# Altium schematic sheet BLDC_DEV_LKS074D(O)_V1.10.schdoc
size A1; SheetNumber: 1; SheetTotal: 1
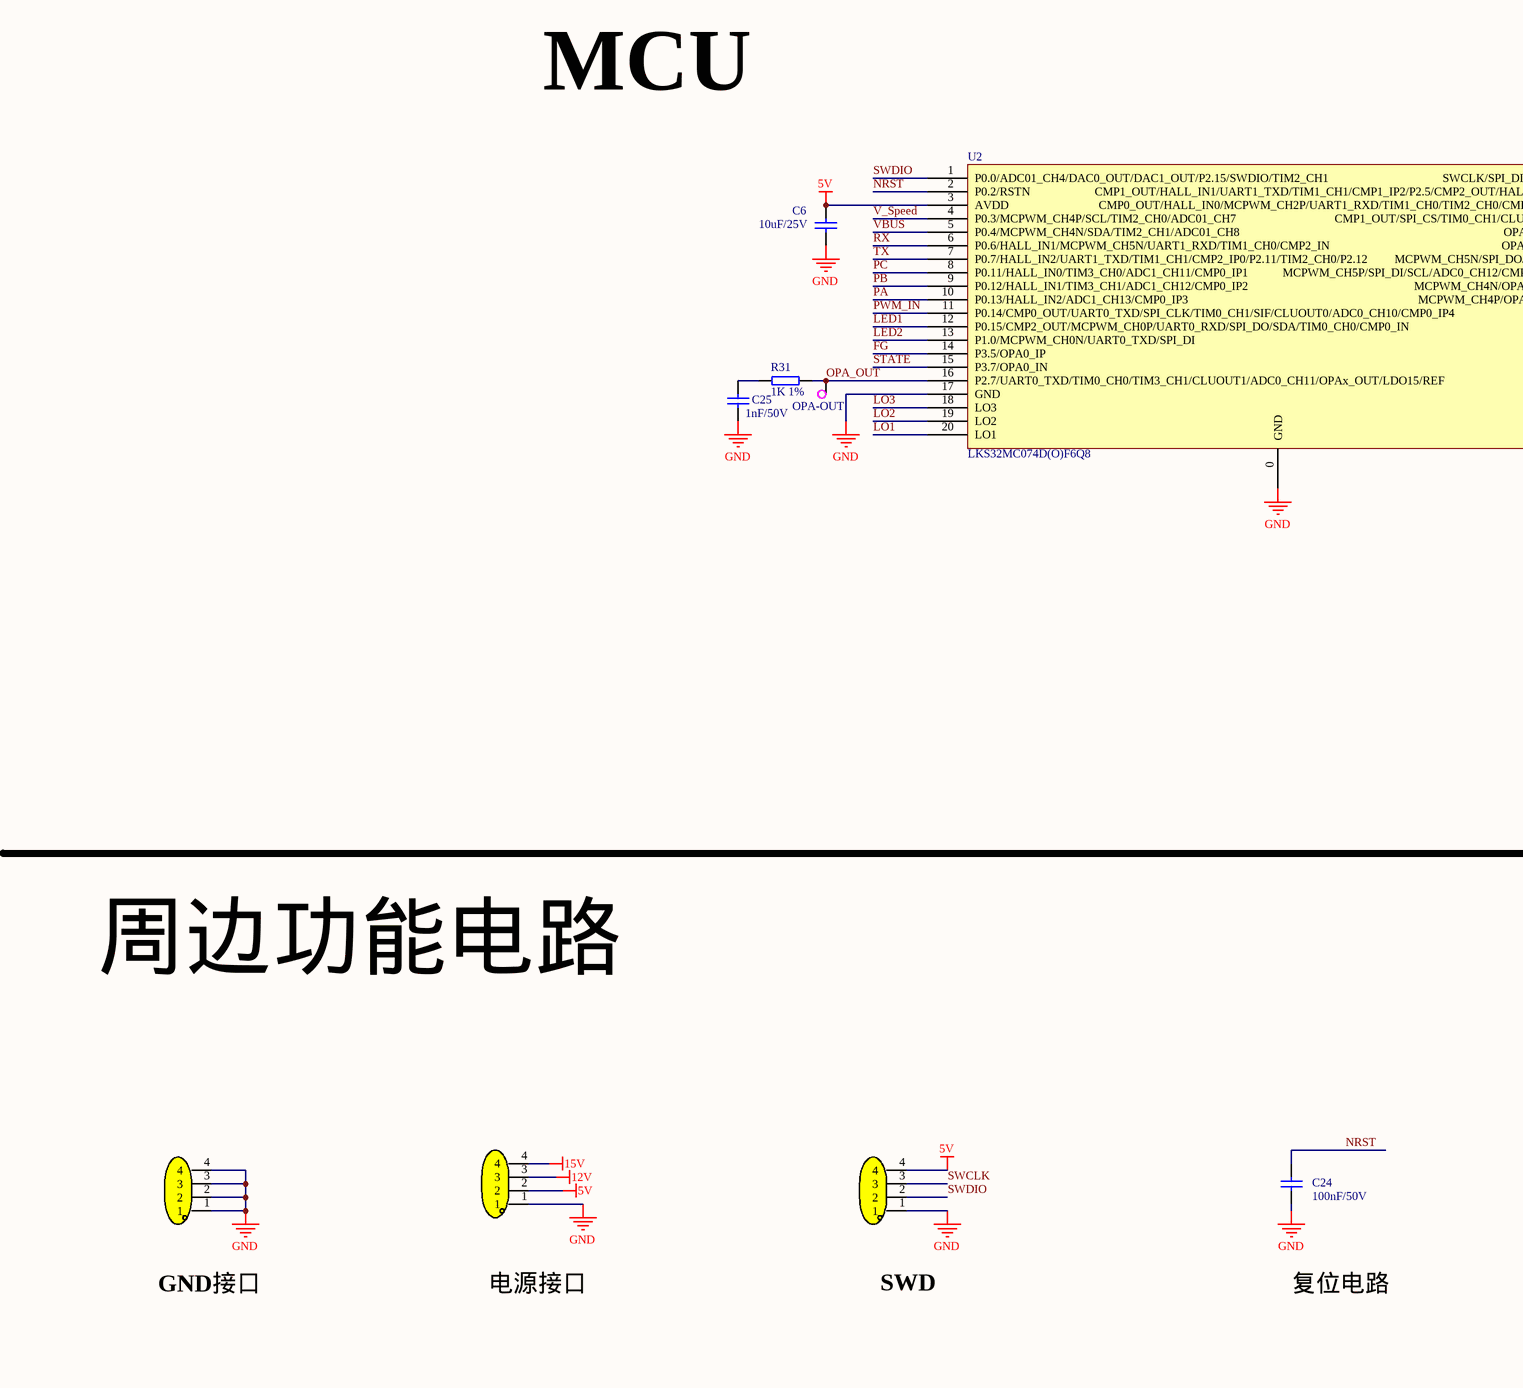
[diagram p0: BLDC_DEV_LKS074D(O)_V1.10.schdoc, top left]
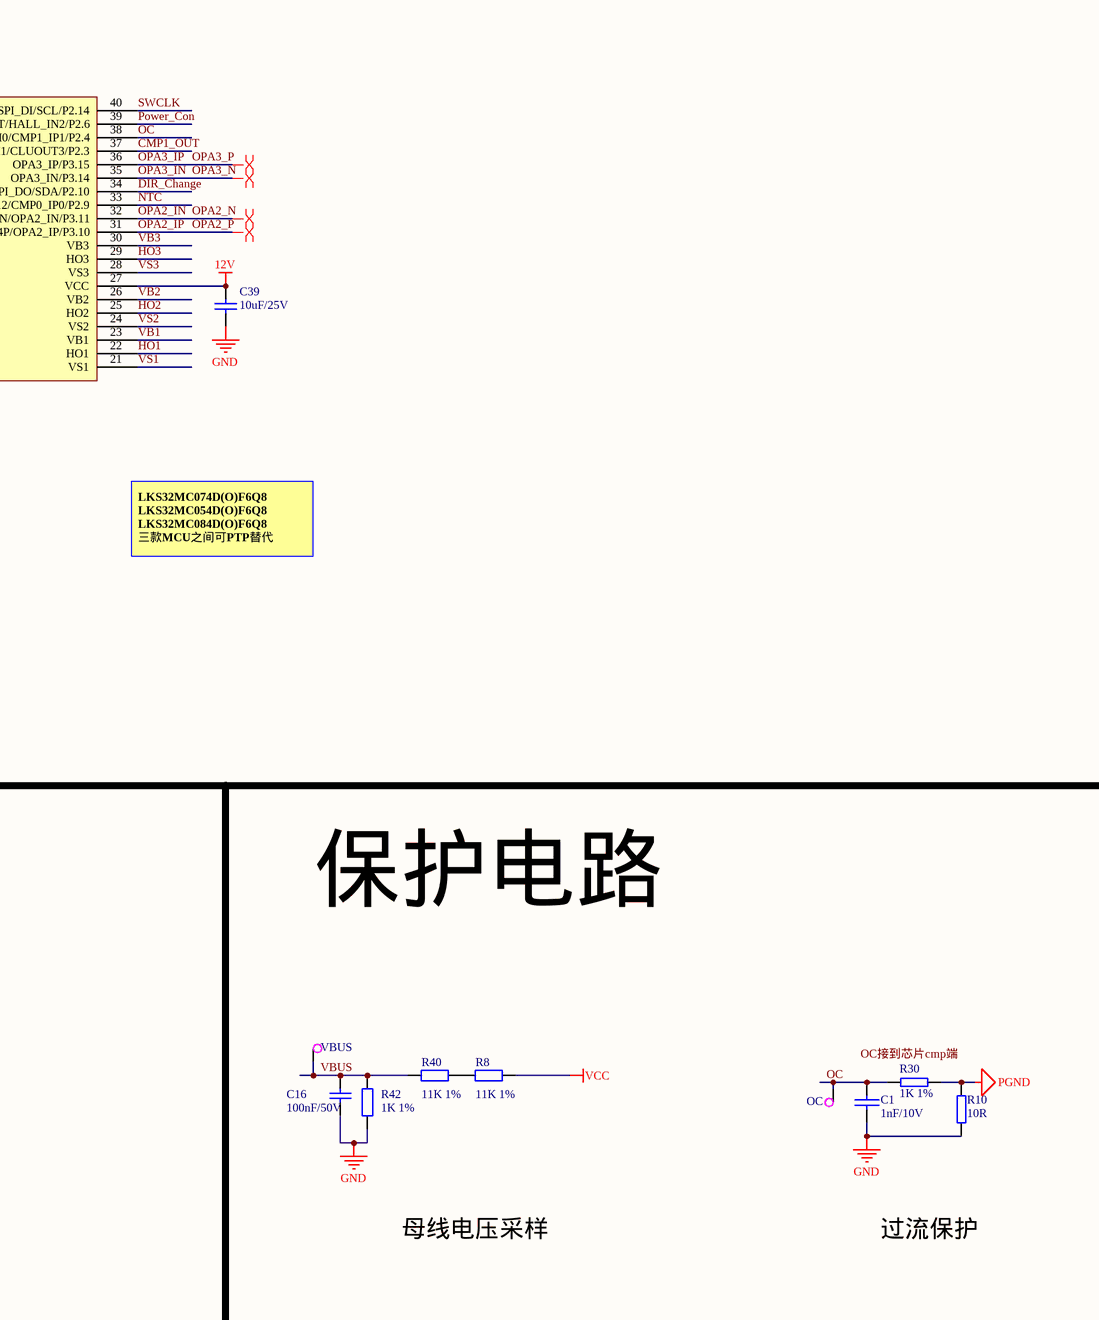
[diagram p1: BLDC_DEV_LKS074D(O)_V1.10.schdoc, top middle]
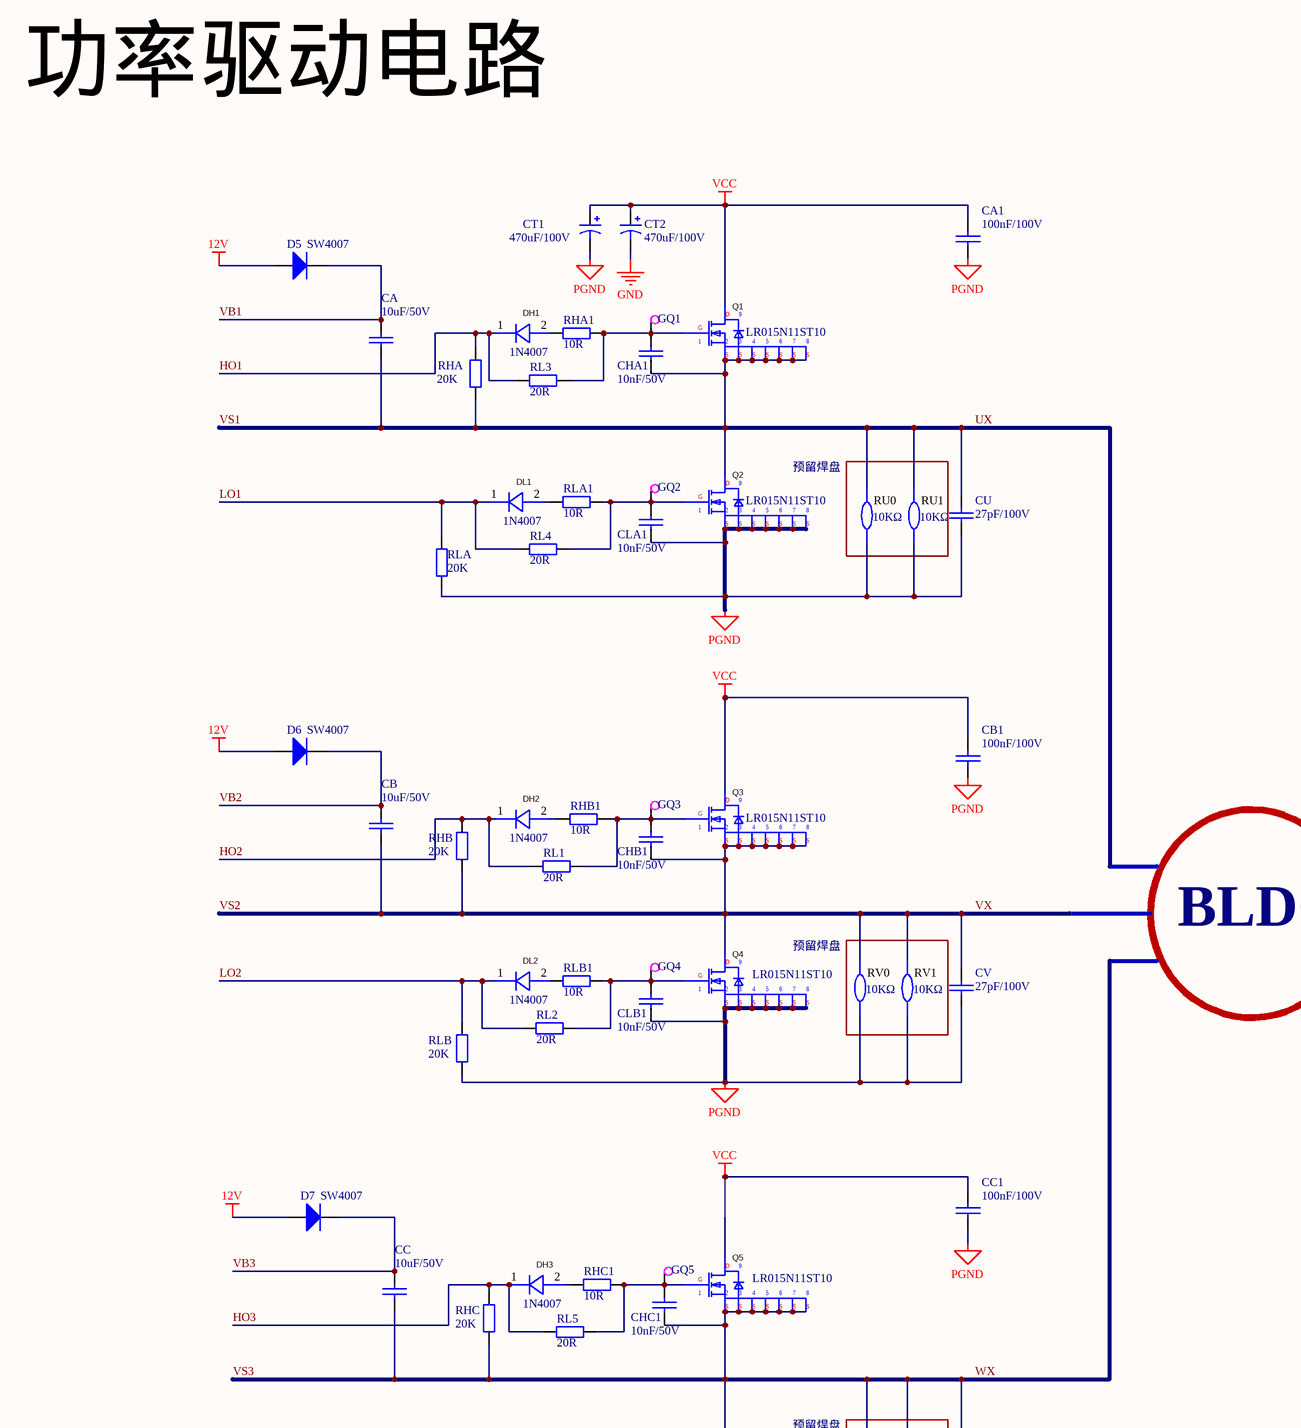
[diagram p2: BLDC_DEV_LKS074D(O)_V1.10.schdoc, top right]
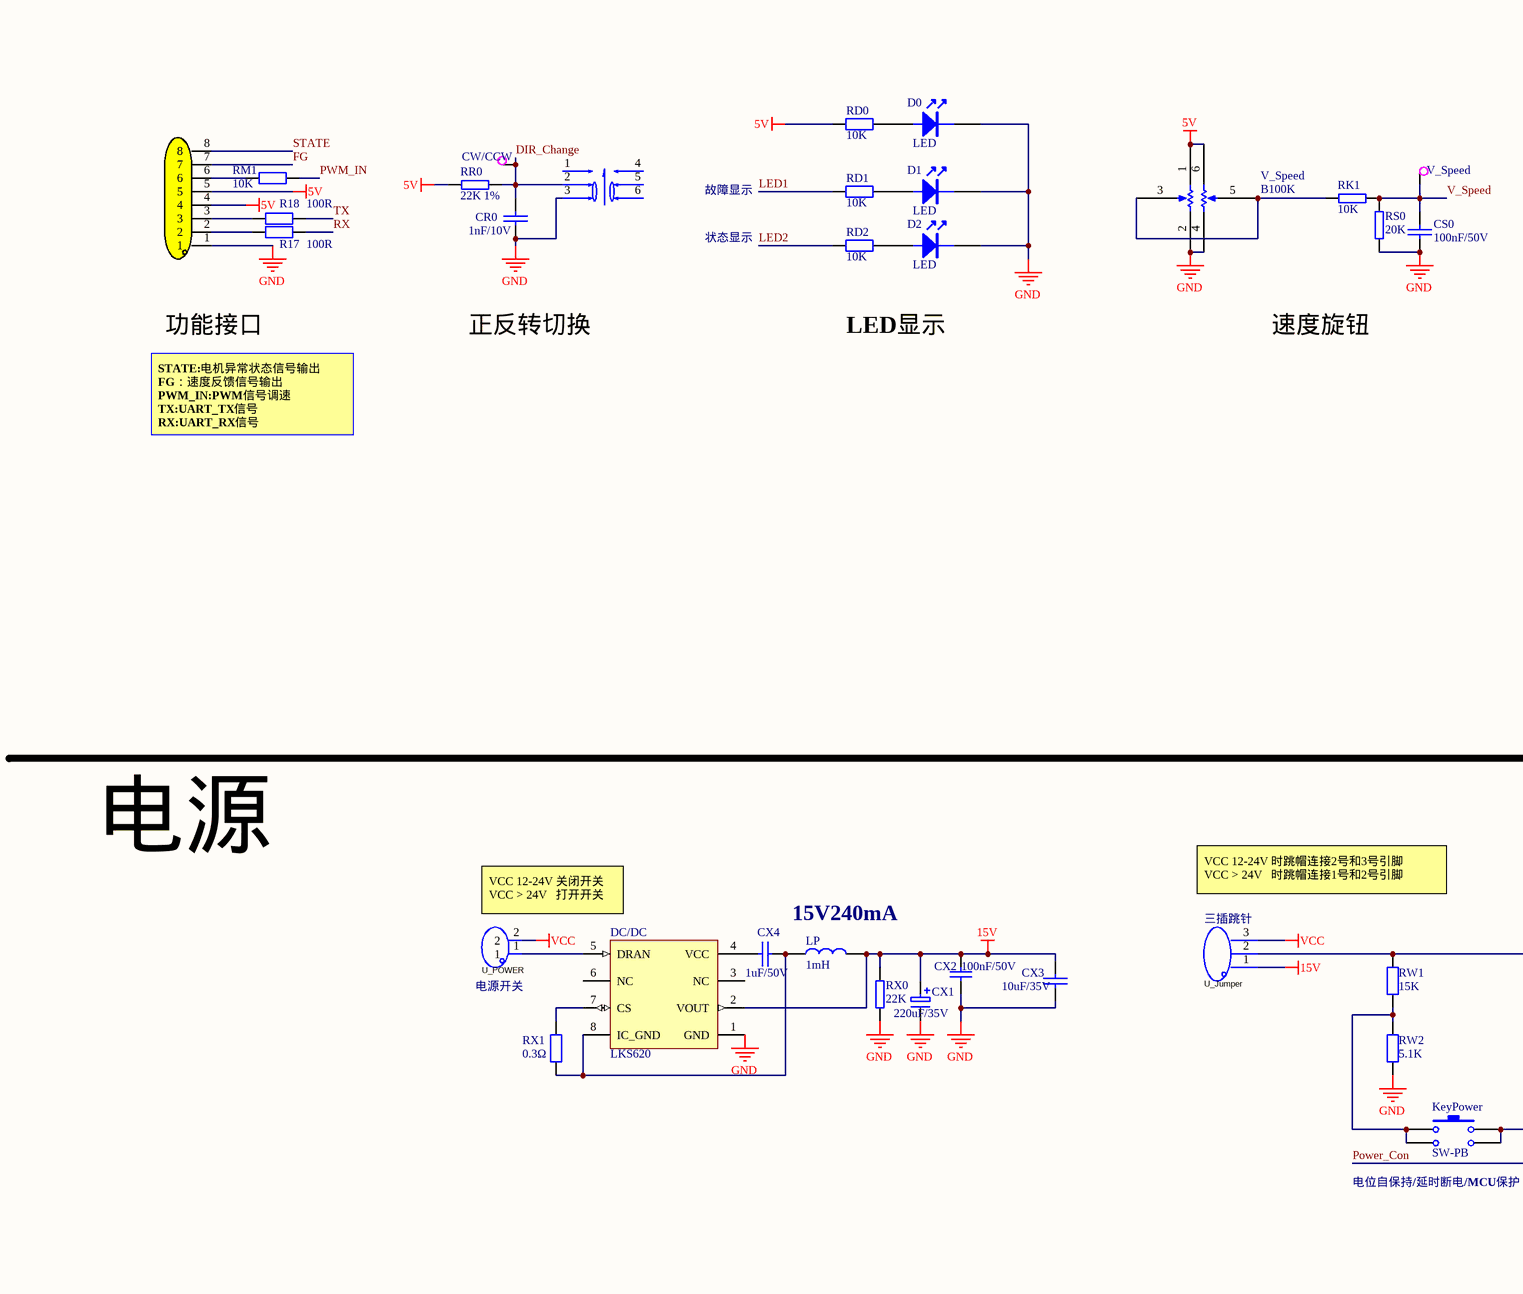
[diagram p3: BLDC_DEV_LKS074D(O)_V1.10.schdoc, bottom left]
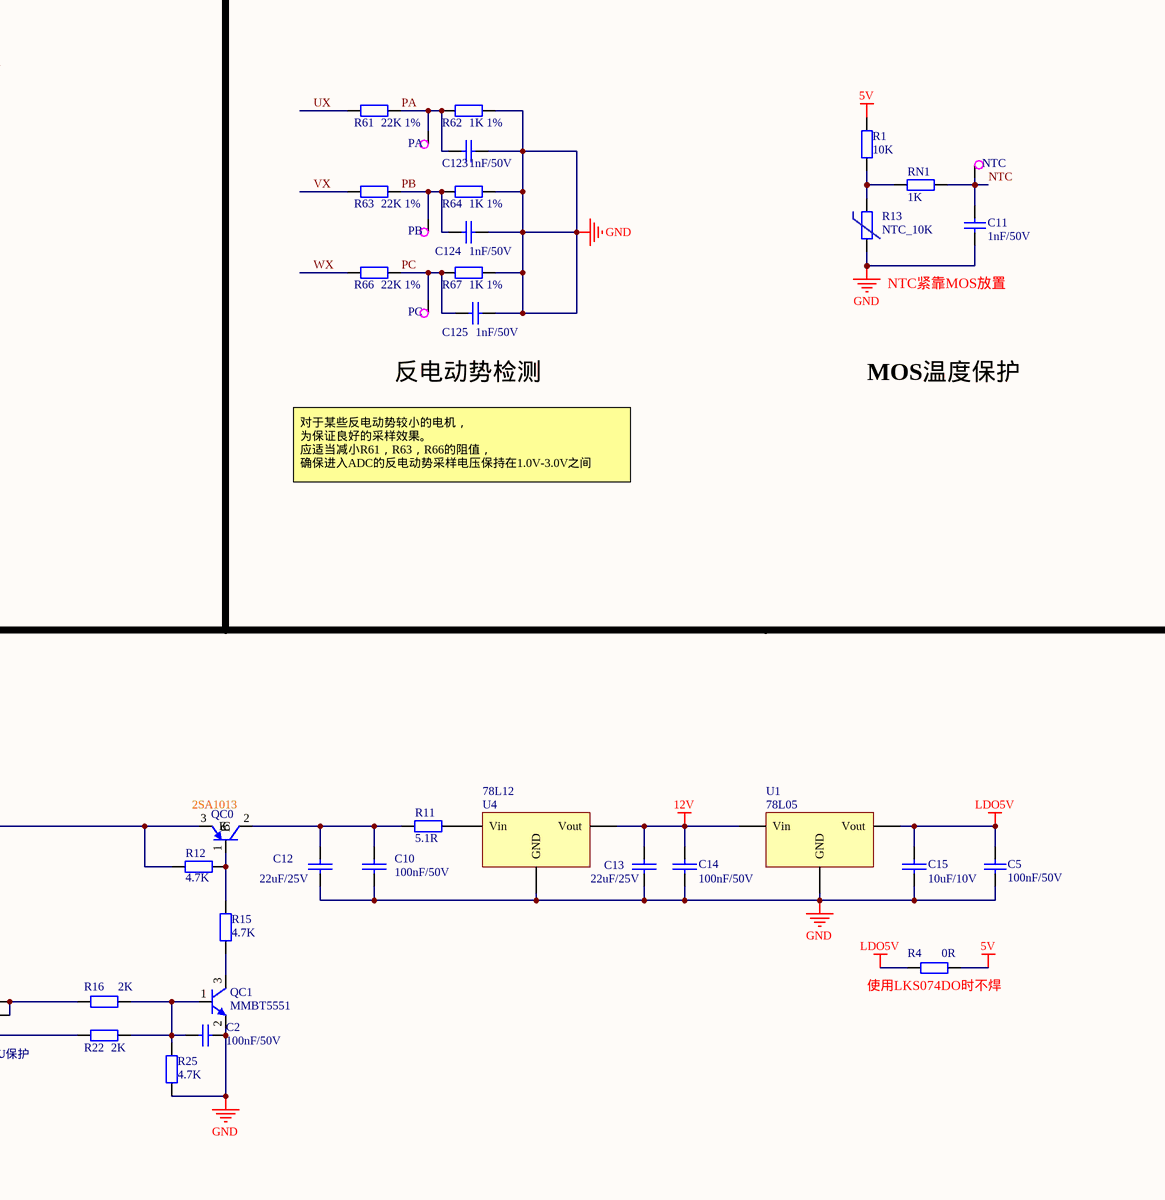
[diagram p4: BLDC_DEV_LKS074D(O)_V1.10.schdoc, bottom middle]
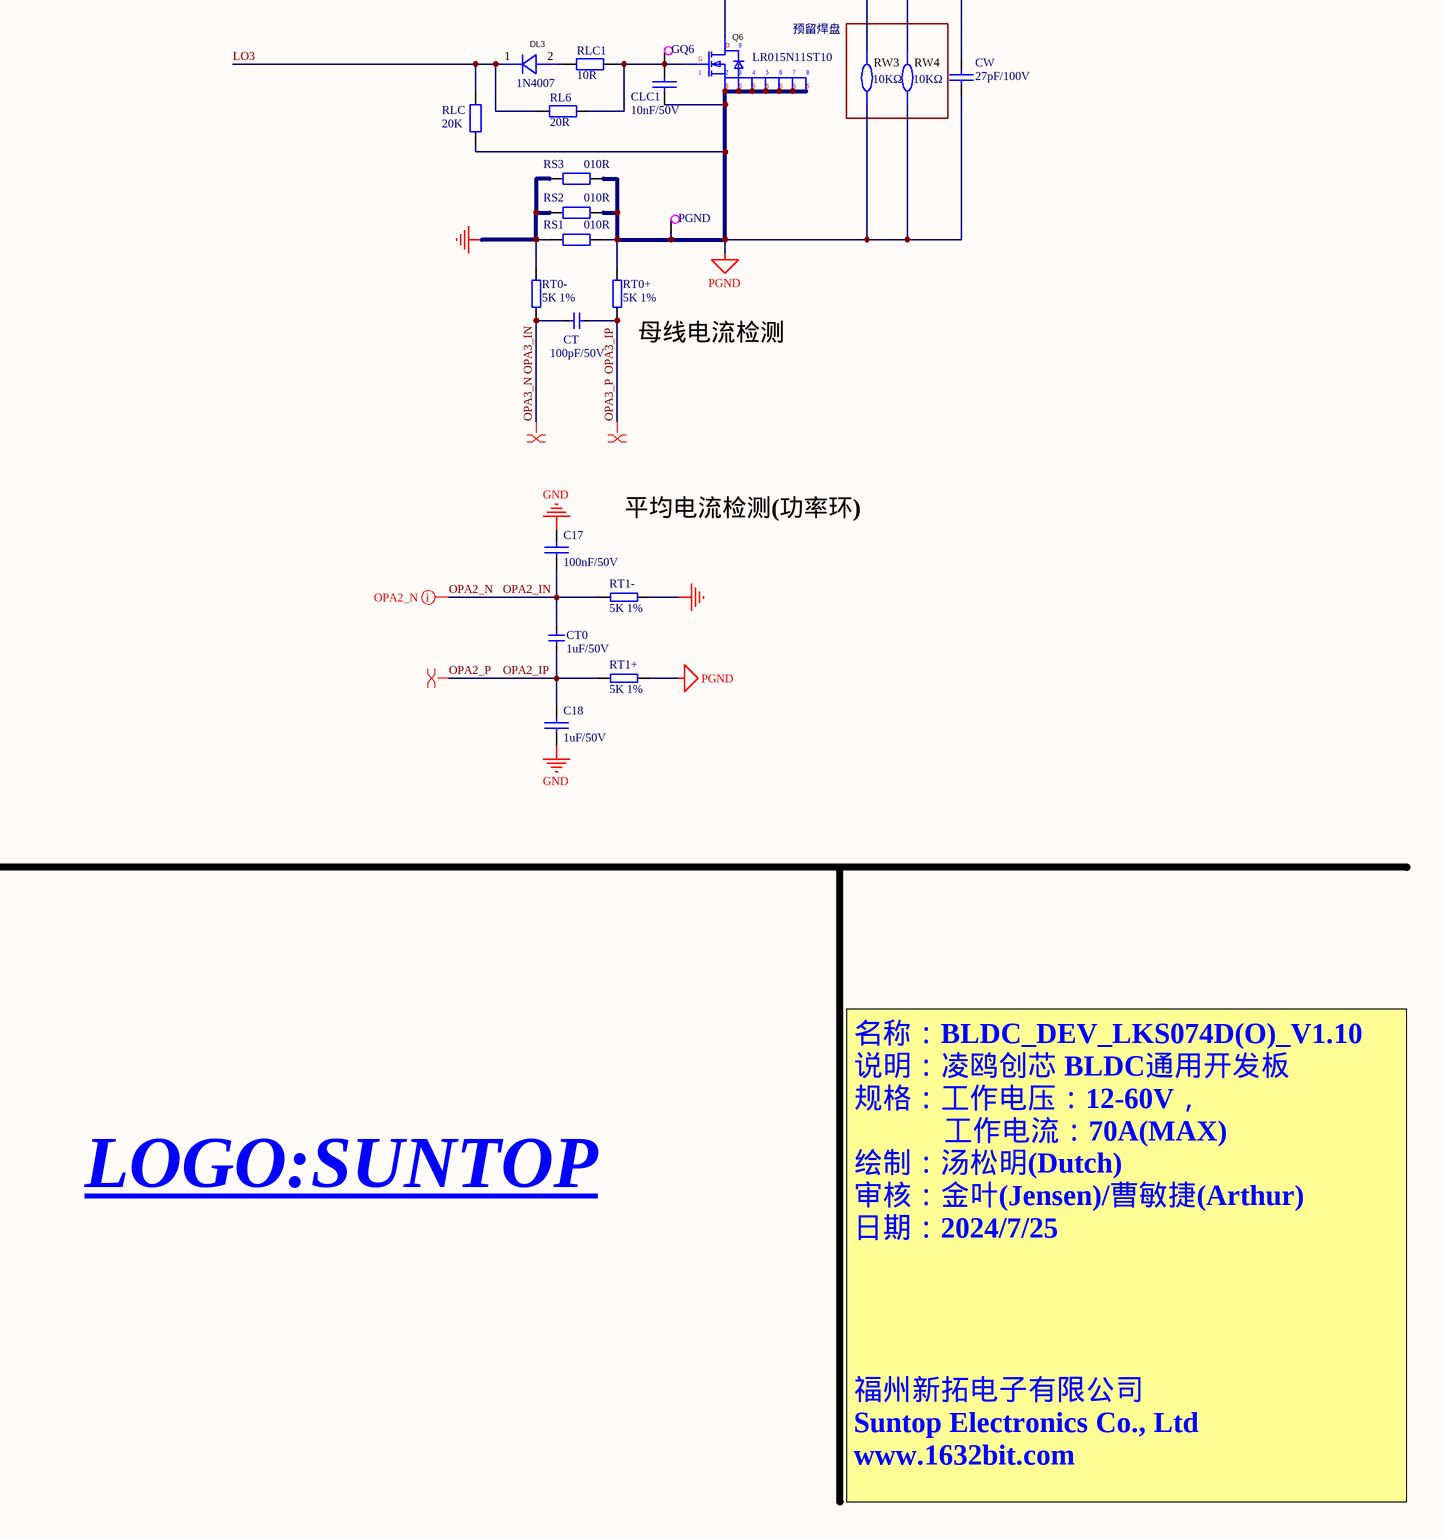
[diagram p5: BLDC_DEV_LKS074D(O)_V1.10.schdoc, bottom right]

## Parts
(Parts that share a designator on the sheet are numbered #1, #2 ... from top to bottom, then left to right.)
C1  1nF/10V  [0603C]
C2  100nF/50V  [0603C]
C5  100nF/50V  [0603C]
C6  10uF/25V  [0603C]
C10  100nF/50V  [0603C]
C11  1nF/50V  [0603C]
C12  22uF/25V  [1206]
C13  22uF/25V  [1206]
C14  100nF/50V  [0603C]
C15  10uF/10V  [1206]
C16  100nF/50V  [0603C]
C17  100nF/50V  [0603C]
C18  1uF/50V  [0603C]
C24  100nF/50V  [0603C]
C25  1nF/50V  [0603C]
C39  10uF/25V  [0805C]
C123  1nF/50V  [0603C]
C124  1nF/50V  [0603C]
C125  1nF/50V  [0603C]
CA  10uF/50V  [1206C]
CA1  100nF/100V  [0805C]
CB  10uF/50V  [1206C]
CB1  100nF/100V  [0805C]
CC  10uF/50V  [1206C]
CC1  100nF/100V  [0805C]
CHA1  10nF/50V  [0603C]
CHB1  10nF/50V  [0603C]
CHC1  10nF/50V  [0603C]
CLA1  10nF/50V  [0603C]
CLB1  10nF/50V  [0603C]
CLC1  10nF/50V  [0603C]
CR0  1nF/10V  [0603C]
CS0  100nF/50V  [0603C]
CT  100pF/50V  [0603C]
CT0  1uF/50V  [0603C]
CT1  470uF/100V  [CAP-TH_BD16.0-P7.50-D1.2-FD]
CT2  470uF/100V  [CAP-TH_BD16.0-P7.50-D1.2-FD]
CU  27pF/100V  [0603C]
CV  27pF/100V  [0603C]
CW  27pF/100V  [0603C]
CW/CCW#1  TestP  [TP-40]  (value not drawn)
CW/CCW#2  XKB7070-Z  [SW-TH_6P-L7.0-W7.0-P2.00]  (value not drawn)
CX1  220uF/35V  [EC-8]
CX2  100nF/50V  [0603C]
CX3  10uF/35V  [0603C]
CX4  1uF/50V  [0603C]
D0  LED  [LED0805-R-RD]
D1  LED  [LED0805-R-RD]
D2  LED  [LED0805-R-RD]
D5  SW4007  [SOD-123]
D6  SW4007  [SOD-123]
D7  SW4007  [SOD-123]
DC/DC  LKS620  [SOP8-NCE4614]
DH1  1N4007  [SMA_L4.3-W2.5-LS5.0-RD]
DH2  1N4007  [SMA_L4.3-W2.5-LS5.0-RD]
DH3  1N4007  [SMA_L4.3-W2.5-LS5.0-RD]
DL1  1N4007  [SMA_L4.3-W2.5-LS5.0-RD]
DL2  1N4007  [SMA_L4.3-W2.5-LS5.0-RD]
DL3  1N4007  [SMA_L4.3-W2.5-LS5.0-RD]
FUN-PIN  ZX-XH2.54-8PZZ  [CONN-TH_8P-P2.50-XH2.54-8P]  (value not drawn)
GND  ZX-XH2.54-4PZZ  [CONN-TH_4P-P2.50_4PIN]  (value not drawn)
GQ1  TestP  [TP-40]  (value not drawn)
GQ2  TestP  [TP-40]  (value not drawn)
GQ3  TestP  [TP-40]  (value not drawn)
GQ4  TestP  [TP-40]  (value not drawn)
GQ5  TestP  [TP-40]  (value not drawn)
GQ6  TestP  [TP-40]  (value not drawn)
KeyPower  SW-PB  [SW-PB  12*12]
LP  1mH  [IND-TH_BD9.5-P5.20-D0.6]
NTC  TestP  [TP-40]  (value not drawn)
OC  TestP  [TP-40]  (value not drawn)
OPA-OUT  TestP  [TP-40]  (value not drawn)
PA  TestP  [TP-40]  (value not drawn)
PB  TestP  [TP-40]  (value not drawn)
PC  TestP  [TP-40]  (value not drawn)
PGND  TestP  [TP-40]  (value not drawn)
POWER  ZX-XH2.54-4PZZ  [CONN-TH_4P-P2.50_4PIN]  (value not drawn)
Q1  LR015N11ST10  [TOLL-8L]
Q2  LR015N11ST10  [TOLL-8L]
Q3  LR015N11ST10  [TOLL-8L]
Q4  LR015N11ST10  [TOLL-8L]
Q5  LR015N11ST10  [TOLL-8L]
Q6  LR015N11ST10  [TOLL-8L]
QC0  2SA1013  [SOT89N]
QC1  MMBT5551  [SOT-23]
R1  10K  [0603R]
R4  0R  [0603R]
R8  11K 1%  [0603R]
R10  10R  [0603R]
R11  5.1R  [0603R]
R12  4.7K  [0603R]
R13  NTC_10K  [0805R]
R15  4.7K  [0603R]
R16  2K  [0603R]
R17  100R  [0603R]
R18  100R  [0603R]
R22  2K  [0603R]
R25  4.7K  [0603R]
R30  1K 1%  [0603R]
R31  1K 1%  [0603R]
R40  11K 1%  [0603R]
R42  1K 1%  [0603R]
R61  22K 1%  [0603R]
R62  1K 1%  [0603R]
R63  22K 1%  [0603R]
R64  1K 1%  [0603R]
R66  22K 1%  [0603R]
R67  1K 1%  [0603R]
RD0  10K  [0603R]
RD1  10K  [0603R]
RD2  10K  [0603R]
RHA  20K  [0603R]
RHA1  10R  [0603R]
RHB  20K  [0603R]
RHB1  10R  [0603R]
RHC  20K  [0603R]
RHC1  10R  [0603R]
RK1  10K  [0603R]
RL1  20R  [0603R]
RL2  20R  [0603R]
RL3  20R  [0603R]
RL4  20R  [0603R]
RL5  20R  [0603R]
RL6  20R  [0603R]
RLA  20K  [0603R]
RLA1  10R  [0603R]
RLB  20K  [0603R]
RLB1  10R  [0603R]
RLC  20K  [0603R]
RLC1  10R  [0603R]
RM1  10K  [0603R]
RN1  1K  [0603R]
RR0  22K 1%  [0603R]
RS0  20K  [0603R]
RS1  010R  [2512R]
RS2  010R  [2512R]
RS3  010R  [2512R]
RT0+  5K 1%  [0603R]
RT0-  5K 1%  [0603R]
RT1+  5K 1%  [0603R]
RT1-  5K 1%  [0603R]
RU0  10KΩ  [R1206]
RU1  10KΩ  [R1206]
RV0  10KΩ  [R1206]
RV1  10KΩ  [R1206]
RW1  15K  [0603R]
RW2  5.1K  [0603R]
RW3  10KΩ  [R1206]
RW4  10KΩ  [R1206]
RX0  22K  [0603R]
RX1  0.3Ω  [0603R]
SWD  ZX-XH2.54-4PZZ  [CONN-TH_4P-P2.50_4PIN]  (value not drawn)
U1  78L05  [SOT89]
U2  LKS32MC074D(O)F6Q8  [QFN40]
U4  78L12  [SOT89]
U_Jumper  826629-3  [HDR-TH_3P-P2.54-V-M-1]  (value not drawn)
U_POWER  SDDJE11600  [SW-TH_SDDJE11600]  (value not drawn)
V_Speed#1  TestP  [TP-40]  (value not drawn)
V_Speed#2  B100K  [RK097-W]
VBUS  TestP  [TP-40]  (value not drawn)

## Nets
5V: C6.2 FUN-PIN.4 FUN-PIN.5 POWER.2 R1.2 R4.2 RD0.1 RR0.2 SWD.4 U2.3(AVDD) V_Speed#2.1(TOP) V_Speed#2.6(TOP)
12V: C13.1 C14.1 C39.2 D5.1(A) D6.1(A) D7.1(A) POWER.3 U1.3(Vin) U2.27(VCC) U4.1(Vout)
15V: CX1.1 CX2.2 CX3.2 DC/DC.2(VOUT) LP.2 POWER.4 RX0.2 U_Jumper.1
GND: C1.2 C2.2 C5.1 C6.1 C10.2 C11.1 C12.2 C13.2 C14.2 C15.2 C16.2 C17.1 C18.2 C24.1 C25.1 C39.1 C123.2 C124.2 C125.2 CR0.2 CS0.2 CT2.2 CW/CCW#2.3 CX1.2 CX2.1 CX3.1 D0.2(K) D1.2(K) D2.2(K) DC/DC.1(GND) FUN-PIN.1 GND.1 GND.2 GND.3 GND.4 POWER.1 QC1.2(E) R10.2 R13.1 R25.1 R42.1 R62.1 R64.1 R67.1 RS0.1 RS1.2 RS2.2 RS3.2 RT0-.2 RT1-.1 RW2.1 RX0.1 SWD.1 U1.2(GND) U2.0(GND) U2.17(GND) U4.2(GND) V_Speed#2.2(TAP) V_Speed#2.4(BOT)
LDO5V: C5.2 C15.1 R4.1 U1.1(Vout)
PGND: CA1.2 CB1.2 CC1.2 CLA1.2 CLB1.2 CLC1.2 CT1.2 CU.2 CV.2 CW.2 PGND.1 Q2.2(S) Q2.3(S) Q2.4(S) Q2.5(S) Q2.6(S) Q2.7(S) Q2.8(S) Q4.2(S) Q4.3(S) Q4.4(S) Q4.5(S) Q4.6(S) Q4.7(S) Q4.8(S) Q6.2(S) Q6.3(S) Q6.4(S) Q6.5(S) Q6.6(S) Q6.7(S) Q6.8(S) R10.1 R30.1 RLA.1 RLB.1 RLC.1 RS1.1 RS2.1 RS3.1 RT0+.2 RT1+.1 RU0.1 RU1.1 RV0.1 RV1.1 RW3.1 RW4.1
VCC: CA1.1 CB1.1 CC1.1 CT1.1 CT2.1 Q1.9(D) Q3.9(D) Q5.9(D) R8.1 U_Jumper.3 U_POWER.2
CMP1_OUT: U2.37(CMP1_OUT/SPI_CS/TIM0_CH1/CLUOUT3/P2.3)
DIR_Change: CR0.1 CW/CCW#1.1 CW/CCW#2.2 RR0.1 U2.34(MCPWM_CH5N/SPI_DO/SDA/P2.10)
FG: FUN-PIN.7 U2.14(P3.5/OPA0_IP)
HO1: DH1.1(K) RHA.2 RL3.1 U2.22(HO1)
HO2: DH2.1(K) RHB.2 RL1.1 U2.25(HO2)
HO3: DH3.1(K) RHC.2 RL5.1 U2.29(HO3)
LED1: RD1.1 U2.12(P0.15/CMP2_OUT/MCPWM_CH0P/UART0_RXD/SPI_DO/SDA/TIM0_CH0/CMP0_IN)
LED2: RD2.1 U2.13(P1.0/MCPWM_CH0N/UART0_TXD/SPI_DI)
LO1: DL1.1(K) RL4.1 RLA.2 U2.20(LO1)
LO2: DL2.1(K) RL2.1 RLB.2 U2.19(LO2)
LO3: DL3.1(K) RL6.1 RLC.2 U2.18(LO3)
NRST: C24.2 U2.2(P0.2/RSTN)
NTC: C11.2 NTC.1 RN1.1 U2.33(MCPWM_CH5P/SPI_DI/SCL/ADC0_CH12/CMP0_IP0/P2.9)
OC: C1.1 OC.1 R30.2 U2.38(CMP0_OUT/HALL_IN0/MCPWM_CH2P/UART1_RXD/TIM1_CH0/TIM2_CH0/CMP1_IP1/P2.4)
OPA2_IN: C17.2 CT0.1 RT1-.2 U2.32(MCPWM_CH4N/OPA2_IN/P3.11)  [also labelled OPA2_N]
OPA2_IP: C18.1 CT0.2 RT1+.2 U2.31(MCPWM_CH4P/OPA2_IP/P3.10)  [also labelled OPA2_P]
OPA3_IN: CT.2 RT0-.1 U2.35(OPA3_IN/P3.14)  [also labelled OPA3_N]
OPA3_IP: CT.1 RT0+.1 U2.36(OPA3_IP/P3.15)  [also labelled OPA3_P]
OPA_OUT: OPA-OUT.1 R31.1 U2.16(P2.7/UART0_TXD/TIM0_CH0/TIM3_CH1/CLUOUT1/ADC0_CH11/OPAx_OUT/LDO15/REF)
PA: C123.1 PA.1 R61.1 R62.2 U2.10(P0.13/HALL_IN2/ADC1_CH13/CMP0_IP3)
PB: C124.1 PB.1 R63.1 R64.2 U2.9(P0.12/HALL_IN1/TIM3_CH1/ADC1_CH12/CMP0_IP2)
PC: C125.1 PC.1 R66.1 R67.2 U2.8(P0.11/HALL_IN0/TIM3_CH0/ADC1_CH11/CMP0_IP1)
Power_Con: R22.1 U2.39(CMP1_OUT/HALL_IN1/UART1_TXD/TIM1_CH1/CMP1_IP2/P2.5/CMP2_OUT/HALL_IN2/P2.6)
PWM_IN: RM1.2 U2.11(P0.14/CMP0_OUT/UART0_TXD/SPI_CLK/TIM0_CH1/SIF/CLUOUT0/ADC0_CH10/CMP0_IP4)
RX: R17.2 U2.6(P0.6/HALL_IN1/MCPWM_CH5N/UART1_RXD/TIM1_CH0/CMP2_IN)
STATE: FUN-PIN.8 U2.15(P3.7/OPA0_IN)
SWCLK: SWD.3 U2.40(SWCLK/SPI_DI/SCL/P2.14)
SWDIO: SWD.2 U2.1(P0.0/ADC01_CH4/DAC0_OUT/DAC1_OUT/P2.15/SWDIO/TIM2_CH1)
TX: R18.2 U2.7(P0.7/HALL_IN2/UART1_TXD/TIM1_CH1/CMP2_IP0/P2.11/TIM2_CH0/P2.12)
UX: CA.2 CHA1.2 CU.1 Q1.2(S) Q1.3(S) Q1.4(S) Q1.5(S) Q1.6(S) Q1.7(S) Q1.8(S) Q2.9(D) R61.2 RHA.1 RU0.2 RU1.2 U2.21(VS1)  [also labelled VS1]
V_Speed: CS0.1 RK1.2 RS0.2 U2.4(P0.3/MCPWM_CH4P/SCL/TIM2_CH0/ADC01_CH7) V_Speed#1.1
VB1: CA.1 D5.2(K) U2.23(VB1)
VB2: CB.1 D6.2(K) U2.26(VB2)
VB3: CC.1 D7.2(K) U2.30(VB3)
VBUS: C16.1 R40.2 R42.2 U2.5(P0.4/MCPWM_CH4N/SDA/TIM2_CH1/ADC01_CH8) VBUS.1
VS2: CB.2 CHB1.2 CV.1 Q3.2(S) Q3.3(S) Q3.4(S) Q3.5(S) Q3.6(S) Q3.7(S) Q3.8(S) Q4.9(D) R63.2 RHB.1 RV0.2 RV1.2 U2.24(VS2)  [also labelled VX]
VS3: CC.2 CHC1.2 CW.1 Q5.2(S) Q5.3(S) Q5.4(S) Q5.5(S) Q5.6(S) Q5.7(S) Q5.8(S) Q6.9(D) R66.2 RHC.1 RW3.2 RW4.2 U2.28(VS3)  [also labelled WX]
NetC2_1: C2.1 QC1.1(B) R16.1 R22.2 R25.2
NetC10_1: C10.1 C12.1 QC0.2(C) R11.1
NetC25_2: C25.2 R31.2
NetCHA1_1: CHA1.1 GQ1.1 Q1.1(G) RHA1.2 RL3.2
NetCHB1_1: CHB1.1 GQ3.1 Q3.1(G) RHB1.2 RL1.2
NetCHC1_1: CHC1.1 GQ5.1 Q5.1(G) RHC1.2 RL5.2
NetCLA1_1: CLA1.1 GQ2.1 Q2.1(G) RL4.2 RLA1.2
NetCLB1_1: CLB1.1 GQ4.1 Q4.1(G) RL2.2 RLB1.2
NetCLC1_1: CLC1.1 GQ6.1 Q6.1(G) RL6.2 RLC1.2
NetCX4_1: CX4.1 DC/DC.8(IC_GND) LP.1 RX1.1
NetCX4_2: CX4.2 DC/DC.4(VCC)
NetD0_1: D0.1(A) RD0.2
NetD1_1: D1.1(A) RD1.2
NetD2_1: D2.1(A) RD2.2
NetDC/DC_5: DC/DC.5(DRAN) U_POWER.1
NetDC/DC_7: DC/DC.7(CS) RX1.2
NetDH1_2: DH1.2(A) RHA1.1
NetDH2_2: DH2.2(A) RHB1.1
NetDH3_2: DH3.2(A) RHC1.1
NetDL1_2: DL1.2(A) RLA1.1
NetDL2_2: DL2.2(A) RLB1.1
NetDL3_2: DL3.2(A) RLC1.1
NetFUN-PIN_2: FUN-PIN.2 R17.1
NetFUN-PIN_3: FUN-PIN.3 R18.1
NetFUN-PIN_6: FUN-PIN.6 RM1.1
NetKeyPower_1: KeyPower.1 KeyPower.3 RW1.1 RW2.2
NetKeyPower_2: KeyPower.2 KeyPower.4 R16.2
NetQC0_1: QC0.1(B) R12.2 R15.1
NetQC0_3: QC0.3(E) R12.1 RW1.2 U_Jumper.2
NetQC1_3: QC1.3(C) R15.2
NetR1_1: R1.1 R13.2 RN1.2
NetR8_2: R8.2 R40.1
NetR11_2: R11.2 U4.3(Vin)
NetRK1_1: RK1.1 V_Speed#2.3(BOT) V_Speed#2.5(TAP)

Not connected (* = marked no-connect by the designer): CW/CCW#2 1 4 5 6; DC/DC 3(NC) 6(NC)

## Layout directives
differential pair: OPA2_IN, OPA2_IP, OPA3_IN, OPA3_IP

## Notes on the sheet
- (near Q2) 预留焊盘
- LKS32MC074D(O)F6Q8
  LKS32MC054D(O)F6Q8
  LKS32MC084D(O)F6Q8
  三款MCU之间可PTP替代
- BLDC
- (near Q4) 预留焊盘
- (near Q6) 预留焊盘
- 故障显示
- 状态显示
- STATE:电机异常状态信号输出
  FG：速度反馈信号输出
  PWM_IN:PWM信号调速
  TX:UART_TX信号
  RX:UART_RX信号
- NTC紧靠MOS放置
- 对于某些反电动势较小的电机，
  为保证良好的采样效果。
  应适当减小R61，R63，R66的阻值，
  确保进入ADC的反电动势采样电压保持在1.0V-3.0V之间
- VCC 12-24V 关闭开关
  VCC > 24V   打开开关
- 15V240mA
- VCC 12-24V 时跳帽连接2号和3号引脚
  VCC > 24V   时跳帽连接1号和2号引脚
- (near U_Jumper) 三插跳针
- (near U_POWER) 电源开关
- (near R4) 使用LKS074DO时不焊
- (near KeyPower) 电位自保持/延时断电/MCU保护
- 名称：BLDC_DEV_LKS074D(O)_V1.10
  说明：凌鸥创芯 BLDC通用开发板
  规格：工作电压：12-60V，
  工作电流：70A(MAX)
  绘制：汤松明(Dutch)
  审核：金叶(Jensen)/曹敏捷(Arthur)
  日期：2024/7/25
  福州新拓电子有限公司
  Suntop Electronics Co., Ltd
  www.1632bit.com
- Labels drawn without touching a wire or pin: GND接口, LED显示, LOGO:SUNTOP, MCU, MOS温度保护, OC接到芯片cmp端, SWD, 保护电路, 功率驱动电路, 功能接口, 反电动势检测, 周边功能电路, 复位电路, 平均电流检测(功率环), 正反转切换, 母线电压采样, 母线电流检测, 电源, 电源接口, 过流保护, 速度旋钮

## Library data of the parts
C1 CR0 CS0 = C: C?
C2 C5 C16 CX2 = Cap: Capacitor
  C2 C16: Published: 8-Jun-2000; LatestRevisionDate: 17-Jul-2002; LatestRevisionNote: Re-released for DXP Platform.; PackageReference: RAD-0.3; Publisher: Altium Limited
C6 C24 C25 C39 = Cap Semi: Capacitor (Semiconductor SIM Model)
C10 C12-C15 CX3 CX4 = C: Capacitor
C11 C123-C125 = Cap: Capacitor; Value: 10nF/16V; Published: 8-Jun-2000; LatestRevisionDate: 17-Jul-2002; LatestRevisionNote: Re-released for DXP Platform.; PackageReference: RAD-0.3; Publisher: Altium Limited
C17 C18 CA CA1 CB CB1 CC CC1 CHA1 CHB1 CHC1 CLA1 CLB1 CLC1 CU CV CW = CAP: Capacitor
CT CT0 = CAP
CT1 CT2 = Cap Pol1: Polarized Capacitor (Radial)
CW/CCW#2 = XKB7070-Z: Manufacturer: XKB Connectivity(中国星坤); Add into BOM: yes; Self Lock / No Lock: 自锁; Actuator Style: 矩形按钮; Contact Current: 100mA; Voltage Rating (AC): 250V; Voltage Rating (DC): 30V; Insulation Resistance: 100MΩ; Actuator/Cap Color: 蓝色; With Lamp: 不带; Pin Style: PC引脚; Operating Force: 160gf; Mechanical Life: 10万次; Name: XKB7070-Z; Symbol: XKB7070-Z; Device: XKB7070-Z; LCSC Part Name: 按键开关   7*7插件自锁 蓝白黑; Supplier Part: C318863; Manufacturer Part: XKB7070-Z; Supplier Footprint: 插件; JLCPCB Part Class: Extended Part; Datasheet: https://atta.szlcsc.com/upload/public/pdf/source/20211015/75A682A27A424BDE8D93C2CFA14C38FE.pdf; Supplier: LCSC; Convert to PCB: yes; IP Rating: -; Mounting Style: 直插; Operating Temperature: -15℃~+55℃
CX1 = EC
D5-D7 = Diode: Default Diode; Published: 8-Jun-2000; LatestRevisionDate: 17-Jul-2002; LatestRevisionNote: Re-released for DXP Platform.; PackageDocument: Sep-1996; PackageReference: SMC; Publisher: Altium Limited; Code_JEDEC: DO-214-AB
DC/DC = 620
DH1-DH3 DL1-DL3 = 1N4007_C727081: Manufacturer: TWGMC(台湾迪嘉); Add into BOM: yes; Diode Configuration: 独立式; Forward Voltage (Vf@If): 1.1V@1A; Reverse Voltage (Vr): 1kV; Average Rectified Current (Io): 1A; Reverse Leakage Current: 5uA@1kV; Symbol: 1N4007_C727081; Device: 1N4007_C727081; Manufacturer Part: 1N4007; LCSC Part Name: 电压:1kV 电流:1A; Supplier Part: C727081; Supplier Footprint: SMA(DO-214AC); JLCPCB Part Class: Extended Part; Datasheet: https://atta.szlcsc.com/upload/public/pdf/source/20200828/C727079_3A05254382567072883400655AE0ED46.pdf; Supplier: LCSC; Convert to PCB: yes
FUN-PIN = ZX-XH2.54-8PZZ: Manufacturer: Megastar(兆星); Add into BOM: yes; Pins Structure: 1x8P; Pitch: 2.54mm; Reference Series: XH; Number of PINs Per Row: 8; Current Rating (Max): 3A; Name: ZX-XH2.54-8PZZ; Symbol: ZX-XH2.54-8PZZ; Device: ZX-XH2.54-8PZZ; LCSC Part Name: ZX-XH2.54-8PZZ; Supplier Part: C7429638; Manufacturer Part: ZX-XH2.54-8PZZ; Supplier Footprint: 插件,P=2.54mm; JLCPCB Part Class: Extended Part; Datasheet: https://atta.szlcsc.com/upload/public/pdf/source/20230619/688603DEA58996C00B1F33C46797D2C3.pdf; Supplier: LCSC; Convert to PCB: yes; Mounting Style: 直插; Number of Pins: 8P; Number of Rows: 1; Row Spacing: -; Contact Material: 黄铜; Contact Plating: 锡; Operating Temperature Range: -25℃~+85℃
GND POWER SWD = ZX-XH2.54-4PZZ: Manufacturer: Megastar(兆星); Add into BOM: yes; Pins Structure: 1x4P; Pitch: 2.54mm; Reference Series: XH; Number of PINs Per Row: 4; Current Rating (Max): 3A; Name: ZX-XH2.54-4PZZ; Symbol: ZX-XH2.54-4PZZ; Device: ZX-XH2.54-4PZZ; LCSC Part Name: ZX-XH2.54-4PZZ; Supplier Part: C7429634; Manufacturer Part: ZX-XH2.54-4PZZ; Supplier Footprint: 插件,P=2.54mm; JLCPCB Part Class: Extended Part; Datasheet: https://atta.szlcsc.com/upload/public/pdf/source/20230619/B529A2163E0159A644AB3383D208FB03.pdf; Supplier: LCSC; Convert to PCB: yes; Mounting Style: 直插; Number of Pins: 4P; Number of Rows: 1; Row Spacing: -; Contact Material: 黄铜; Contact Plating: 锡; Operating Temperature Range: -25℃~+85℃
KeyPower = SW-PB: Switch
LP = INDUCTOR1: 工字电感
Q1-Q6 = HT7202: Manufacturer: HXY MOSFET(华轩阳电子); Drain Source Voltage (Vdss): 80V; Add into BOM: yes; Type: 1个N沟道; Continuous Drain Current (Id): 400A; Drain Source On Resistance (RDS(on)@Vgs,Id): 2mΩ@10V; Gate Threshold Voltage (Vgs(th)@Id): 4V; Name: LR015N11ST10; Symbol: HT7202; Device: HT7202; Manufacturer Part: LR015N11ST10; Supplier Footprint: TOLL; LCSC Part Name: 1个N沟道 耐压:80V 电流:400A; Supplier Part: C18198384; JLCPCB Part Class: Extended Part; Datasheet: https://atta.szlcsc.com/upload/public/pdf/source/20230921/B849367E43DEA1E6AF47E51F34FBDCF7.pdf; Supplier: LCSC; Convert to PCB: yes
QC0 = 2SA1013 直插: PNP BJT
QC1 = NPN_C
R1 R4 R12 R15-R18 R22 R25 R42 R61-R64 R66 R67 RHA RHA1 RHB RHB1 RHC RHC1 RL1-RL6 RLA RLA1 RLB RLB1 RLC RLC1 RM1 RN1 RS1-RS3 RX1 = Res2: Resistor
  R1 R12 R15 R16 R22 R25 RHA RHA1 RHB RHB1 RHC RHC1 RL1-RL6 RLA RLA1 RLB RLB1 RLC RLC1 RN1 RS1-RS3 RX1: Published: 8-Jun-2000; LatestRevisionDate: 17-Jul-2002; LatestRevisionNote: Re-released for DXP Platform.; PackageReference: 0603R; Publisher: Altium Limited; PackageDescription: Axial Device, Thru-Hole; 2 Leads; 0.4 in Pin Spacing
  R42: Published: 8-Jun-2000; LatestRevisionDate: 17-Jul-2002; LatestRevisionNote: Re-released for DXP Platform.; PackageReference: 0603R; Publisher: Altium Limited
R8 R40 = Res2: Resistor; Value: 100K; Published: 8-Jun-2000; LatestRevisionDate: 17-Jul-2002; LatestRevisionNote: Re-released for DXP Platform.; PackageReference: 0603R; Publisher: Altium Limited
R10 R30 R31 RR0 = R: R?
R11 RW1 RW2 = Res2: Resistor; Value: 0.47R; Published: 8-Jun-2000; LatestRevisionDate: 17-Jul-2002; LatestRevisionNote: Re-released for DXP Platform.; PackageReference: AXIAL-0.4; Publisher: Altium Limited; PackageDescription: Axial Device, Thru-Hole; 2 Leads; 0.4 in Pin Spacing
R13 = NTC
RD0-RD2 = Res2: Resistor; Value: 2.2K; Published: 8-Jun-2000; LatestRevisionDate: 17-Jul-2002; LatestRevisionNote: Re-released for DXP Platform.; PackageReference: 0603R; Publisher: Altium Limited; PackageDescription: Axial Device, Thru-Hole; 2 Leads; 0.4 in Pin Spacing
RK1 RS0 RT0+ RT0- RT1+ RT1- = RES/1
RU0 RU1 RV0 RV1 RW3 RW4 = 1206W4F1002T5E: Manufacturer: UNI-ROYAL(厚声); Add into BOM: yes; Tolerance: ±1%; Power(Watts): 250mW; Overload Voltage (Max): 200V; Temperature Coefficient: ±100ppm/℃; Symbol: 1206W4F1002T5E; Device: 1206W4F1002T5E; Value: 10KΩ; LCSC Part Name: 10kΩ ±1% 250mW 厚膜电阻; Supplier Part: C17902; Manufacturer Part: 1206W4F1002T5E; Supplier Footprint: 1206; JLCPCB Part Class: Basic Part; Datasheet: https://atta.szlcsc.com/upload/public/pdf/source/20200306/C422600_1E6D84923E4A46A82E41ADD87F860B5C.pdf; Supplier: LCSC; Convert to PCB: yes; Type: 厚膜电阻; Operating Temperature Range: -55℃~+155℃
RX0 = RES2-1
U1 U4 = VOL-78
U2 = LKS32MC074DF8Q8: 芯片
U_Jumper = 826629-3: Manufacturer: TE Connectivity(泰科电子); Add into BOM: yes; Pin Structure: 1x3P; Pitch: 2.54mm; Current Rating (Max): 5A; Name: 826629-3; Symbol: 826629-3; Device: 826629-3; LCSC Part Name: 间距:2.54mm 1x3P 直插; Supplier Part: C306127; Manufacturer Part: 826629-3; Supplier Footprint: 插件,P=2.54mm; JLCPCB Part Class: Extended Part; Datasheet: https://atta.szlcsc.com/upload/public/pdf/source/20181105/C306220_A1767197311F9EA18E5C41C77B28DC02.pdf; Supplier: LCSC; Convert to PCB: yes; Row Spacing: -; Circluar Pins/Square Pins: -; Mounting Type: 直插; Number of Rows: 单排; Number of Pins: 3P; Voltage Rating (Max): -; Length of Mating Pin: -; Insulation Height: 2.8mm; Contact Material: 黄铜; Contact Plating: 锡; Operating Temperature Range: -65℃~+105℃; Color: 绿色
U_POWER = SDDJE11600: Manufacturer: ALPSALPINE(阿尔卑斯阿尔派); Add into BOM: yes; Switch Length: 21mm; Switch Width: 15mm; Switch Height: 24.2mm; Actuator Type: 凹面弯曲; Pin Style: 焊片; Actuator Color: 黑色; Contact Current: 10A; Voltage Rating (AC): 250V; Circuit: 单刀单掷; Actuator Identifier: 无标识; Name: SDDJE11600; Symbol: SDDJE11600; Device: SDDJE11600; LCSC Part Name: 电源开关; Supplier Part: C231759; Manufacturer Part: SDDJE11600; Supplier Footprint: 插件; JLCPCB Part Class: Extended Part; Datasheet: https://atta.szlcsc.com/upload/public/pdf/source/20180613/C231759_9502EEB0D72A7F1BA578B45D62B9B046.pdf; Supplier: LCSC; Convert to PCB: yes; With Lamp: -; Voltage Rating (DC): -; Mechanical Life: -
V_Speed#2 = RPot: Potentiometer; Sim Note: Enter the Resistance value and the set point into parameter fields.; Set Position: 0.5; Published: 8-Jun-2000; LatestRevisionDate: 17-Jul-2002; LatestRevisionNote: Re-released for DXP Platform.; PackageReference: VR5; Publisher: Altium Limited; PackageDescription: Variable Resistor, Thru-Hole; 3 Leads
D0-D2 = LED: ComponentLink1Description: New link; ComponentLink1URL: *